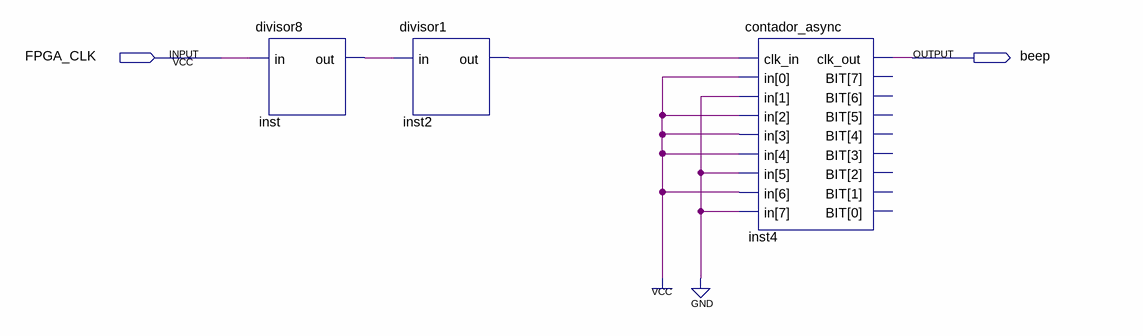
[diagram p0: schematic sheet]
// Quartus schematic buzzer_523hz.bdf as structural Verilog: 3 symbols, 2 pins
module buzzer_523hz (
  input  FPGA_CLK,
  output beep
);

  wire inst2_out, inst_out;

  divisor8 inst (.in(FPGA_CLK), .out(inst_out));
  divisor1 inst2 (.in(inst_out), .out(inst2_out));
  contador_async inst4 (.clk_in(inst2_out), .in(8'b01011101), .clk_out(beep));  // open: BIT
endmodule
